# EAGLE design du-ino (EAGLE 6.4)
DRAWING_REVISION: C

## Sheet 1 of 3
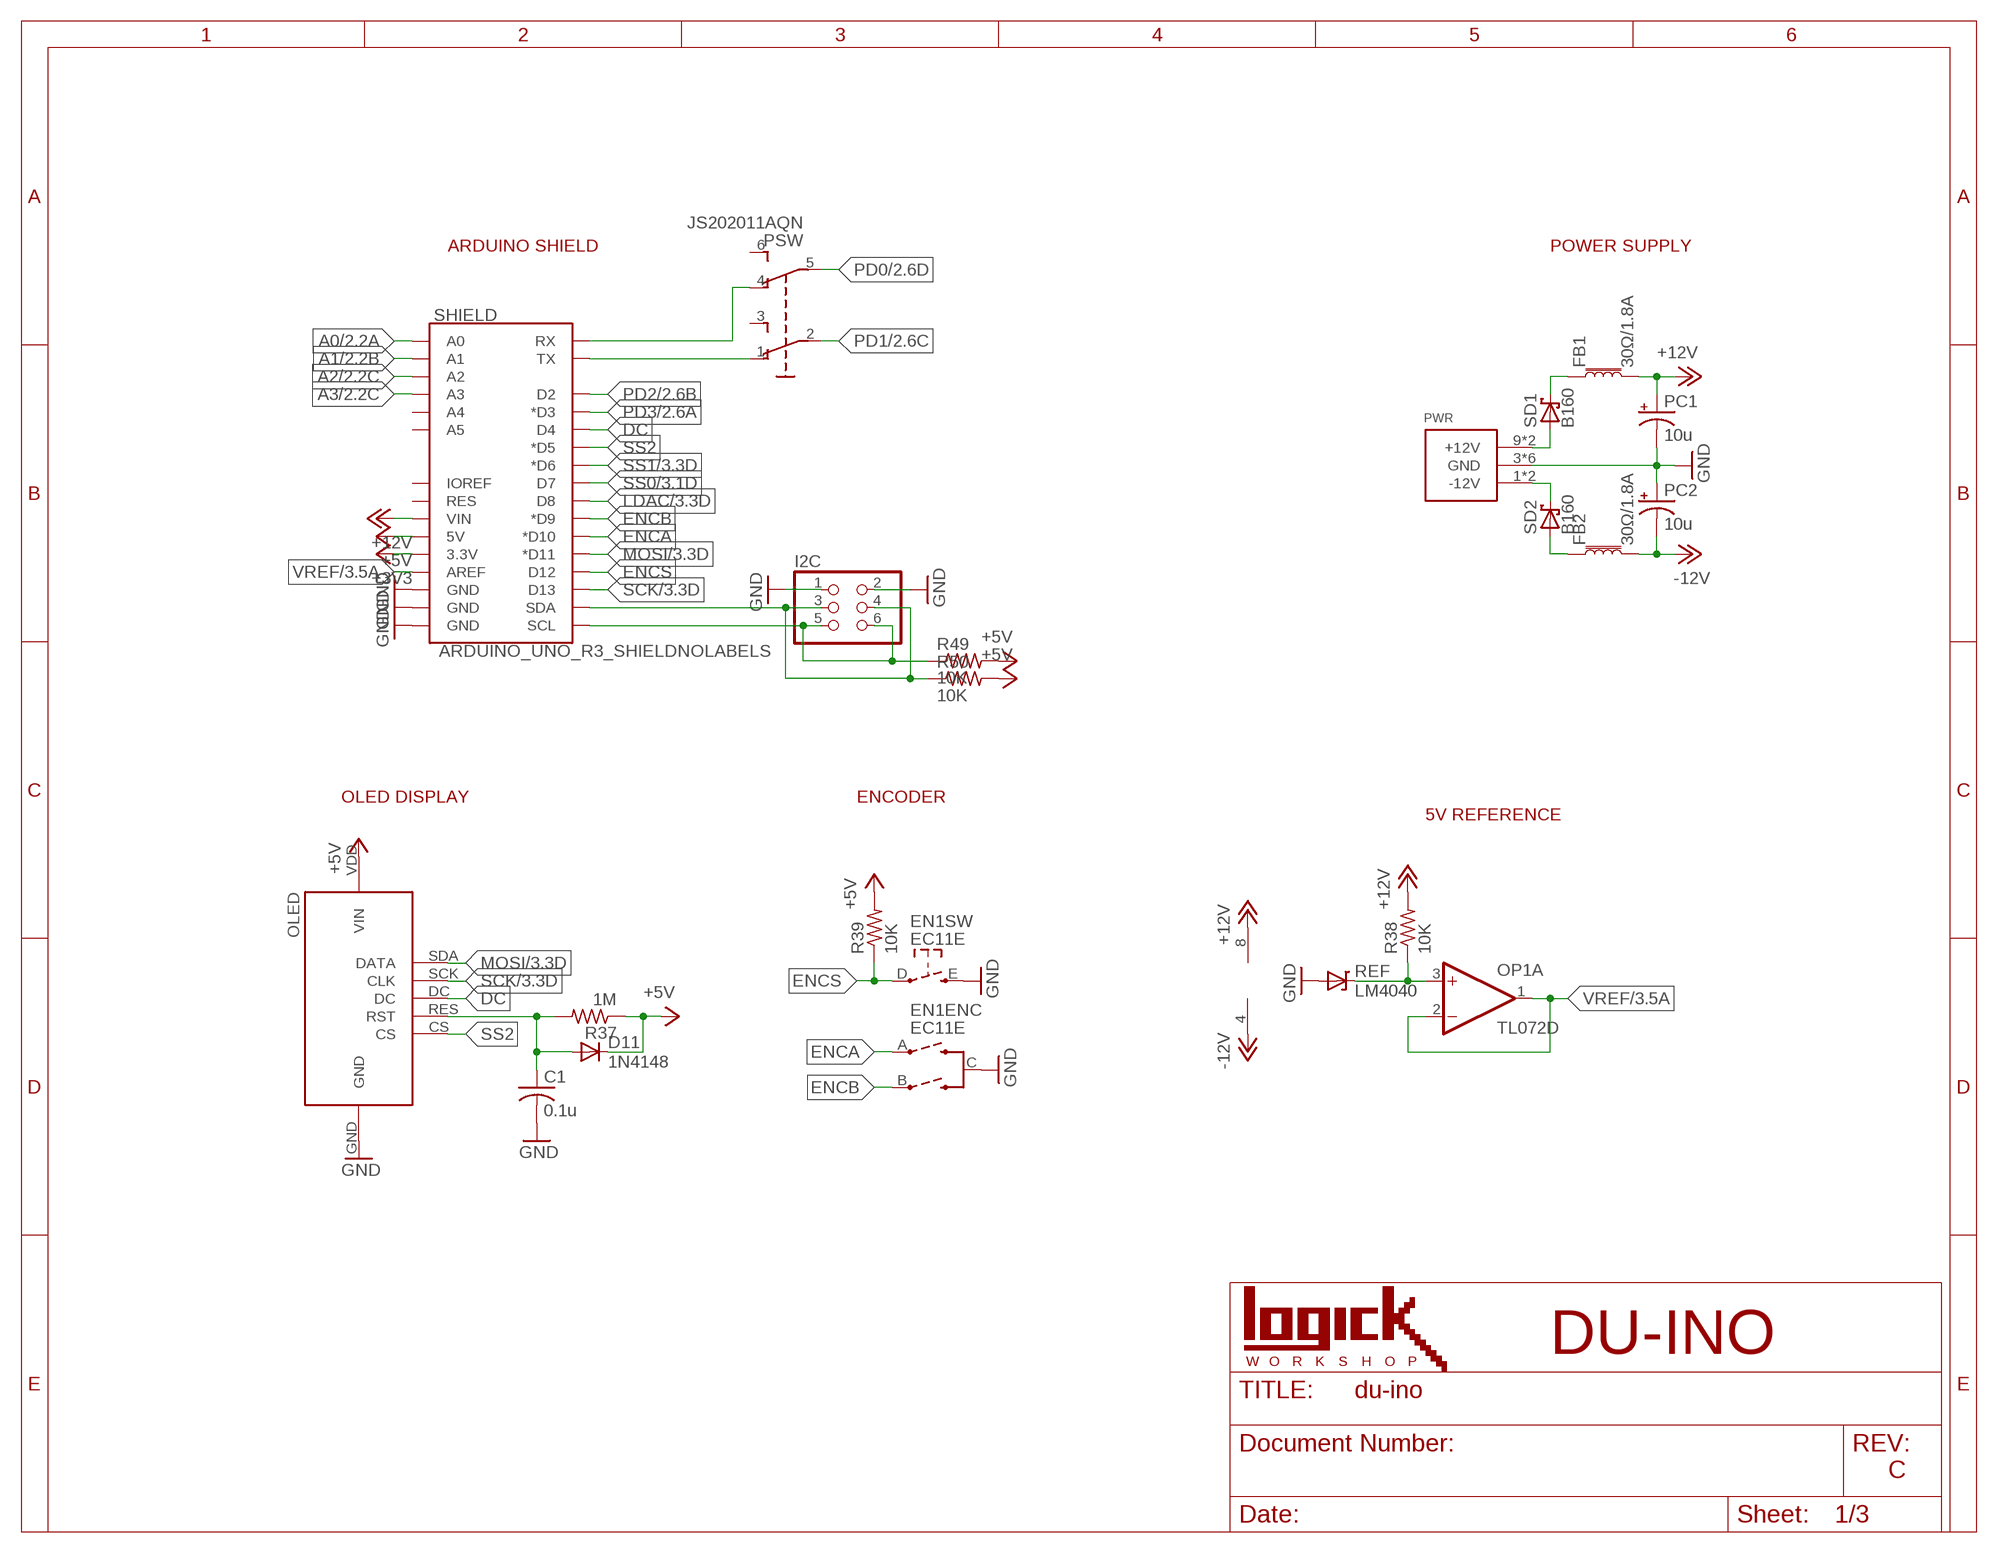
[diagram p0: schematic, sheet 1]

### Parts
C1  0.1u  C-USC0603  [C0603]
D11  1N4148  DIODE-SOD123  [SOD123]
EN1  EC11E  [EC11E]
FB1  30Ω/1.8A  FERRITE_BEAD-0603  [0603]
FB2  30Ω/1.8A  FERRITE_BEAD-0603  [0603]
I2C  PINHD-2X3  [2X03]
OLED  OLED-SAMIORE  [OLED-SAMIORE]
OP1  TL072D  [SO08]
PC1  10u  CPOL-USB  [PANASONIC_B]
PC2  10u  CPOL-USB  [PANASONIC_B]
PSW  JS202011AQN  [JS202011AQN]
PWR  POWER_SIMPLE10  [POWER_10]
R37  1M  R-US_R0603  [R0603]
R38  10K  R-US_R0603  [R0603]
R39  10K  R-US_R0603  [R0603]
R49  10K  R-US_R0603  [R0603]
R50  10K  R-US_R0603  [R0603]
REF  LM4040  [SOT23]
SD1  B160  SCHOTTKY-DIODESMD  [SMB]
SD2  B160  SCHOTTKY-DIODESMD  [SMB]
SHIELD  ARDUINO_UNO_R3_SHIELDNOLABELS  [UNO_R3_SHIELD_NOLABELS]

### Nets
+3V3: SHIELD.3.3V ; also sheet 2
+5V: D11.C OLED.VDD(VIN) R37.1 R39.2 R49.2 R50.2 SHIELD.5V ; also sheet 2,3
+12V: FB1.2 OP1.8(P:V+) PC1.+ R38.2 SHIELD.VIN ; also sheet 2,3
-12V: FB2.2 OP1.4(P:V-) PC2.- ; also sheet 2,3
A0: SHIELD.A0 ; also sheet 2
A1: SHIELD.A1 ; also sheet 2
A2: SHIELD.A2 ; also sheet 2
A3: SHIELD.A3 ; also sheet 2
DC: OLED.DC SHIELD.D4
ENCA: EN1.A(ENC:A) SHIELD.D10(*D10)
ENCB: EN1.B(ENC:B) SHIELD.D9(*D9)
ENCS: EN1.D R39.1 SHIELD.D12
GND: C1.2 EN1.C(ENC:C) EN1.E I2C.1 I2C.2 OLED.GND PC1.- PC2.+ PWR.3(GND) PWR.4(GND) PWR.5(GND) PWR.6(GND) PWR.7(GND) PWR.8(GND) REF.2(A) SHIELD.GND@0(GND) SHIELD.GND@1(GND) SHIELD.GND@2(GND) ; also sheet 2,3
LDAC: SHIELD.D8 ; also sheet 3
MOSI: OLED.SDA(DATA) SHIELD.D11(*D11) ; also sheet 3
N$34: C1.1 D11.A OLED.RES(RST) R37.2
N$57: PWR.1(-12V) PWR.2(-12V) SD2.C
N$58: FB2.1 SD2.A
N$59: FB1.1 SD1.C
N$60: PWR.9(+12V) PWR.10(+12V) SD1.A
N$62: PSW.1(O) SHIELD.TX
N$63: PSW.4(O1) SHIELD.RX
N$68: OP1.3(A:+IN) R38.1 REF.1(C)
PD0: PSW.5(P1) ; also sheet 2
PD1: PSW.2(P) ; also sheet 2
PD2: SHIELD.D2 ; also sheet 2
PD3: SHIELD.D3(*D3) ; also sheet 2
SCK: OLED.SCK(CLK) SHIELD.D13 ; also sheet 3
SCL: I2C.5 I2C.6 R49.1 SHIELD.SCL
SDA: I2C.3 I2C.4 R50.1 SHIELD.SDA
SS0: SHIELD.D7 ; also sheet 3
SS1: SHIELD.D6(*D6) ; also sheet 3
SS2: OLED.CS SHIELD.D5(*D5)
VREF: OP1.1(A:OUT) OP1.2(A:-IN) SHIELD.AREF ; also sheet 3
Unconnected: PSW.3(S) PSW.6(S1) SHIELD.A4 SHIELD.A5 SHIELD.IOREF SHIELD.RES

### Notes on the sheet
- ARDUINO SHIELD | POWER SUPPLY
- OLED DISPLAY | ENCODER
- 5V REFERENCE
- DU-INO
- W | O | R | K | S | H | O | P

## Sheet 2 of 3
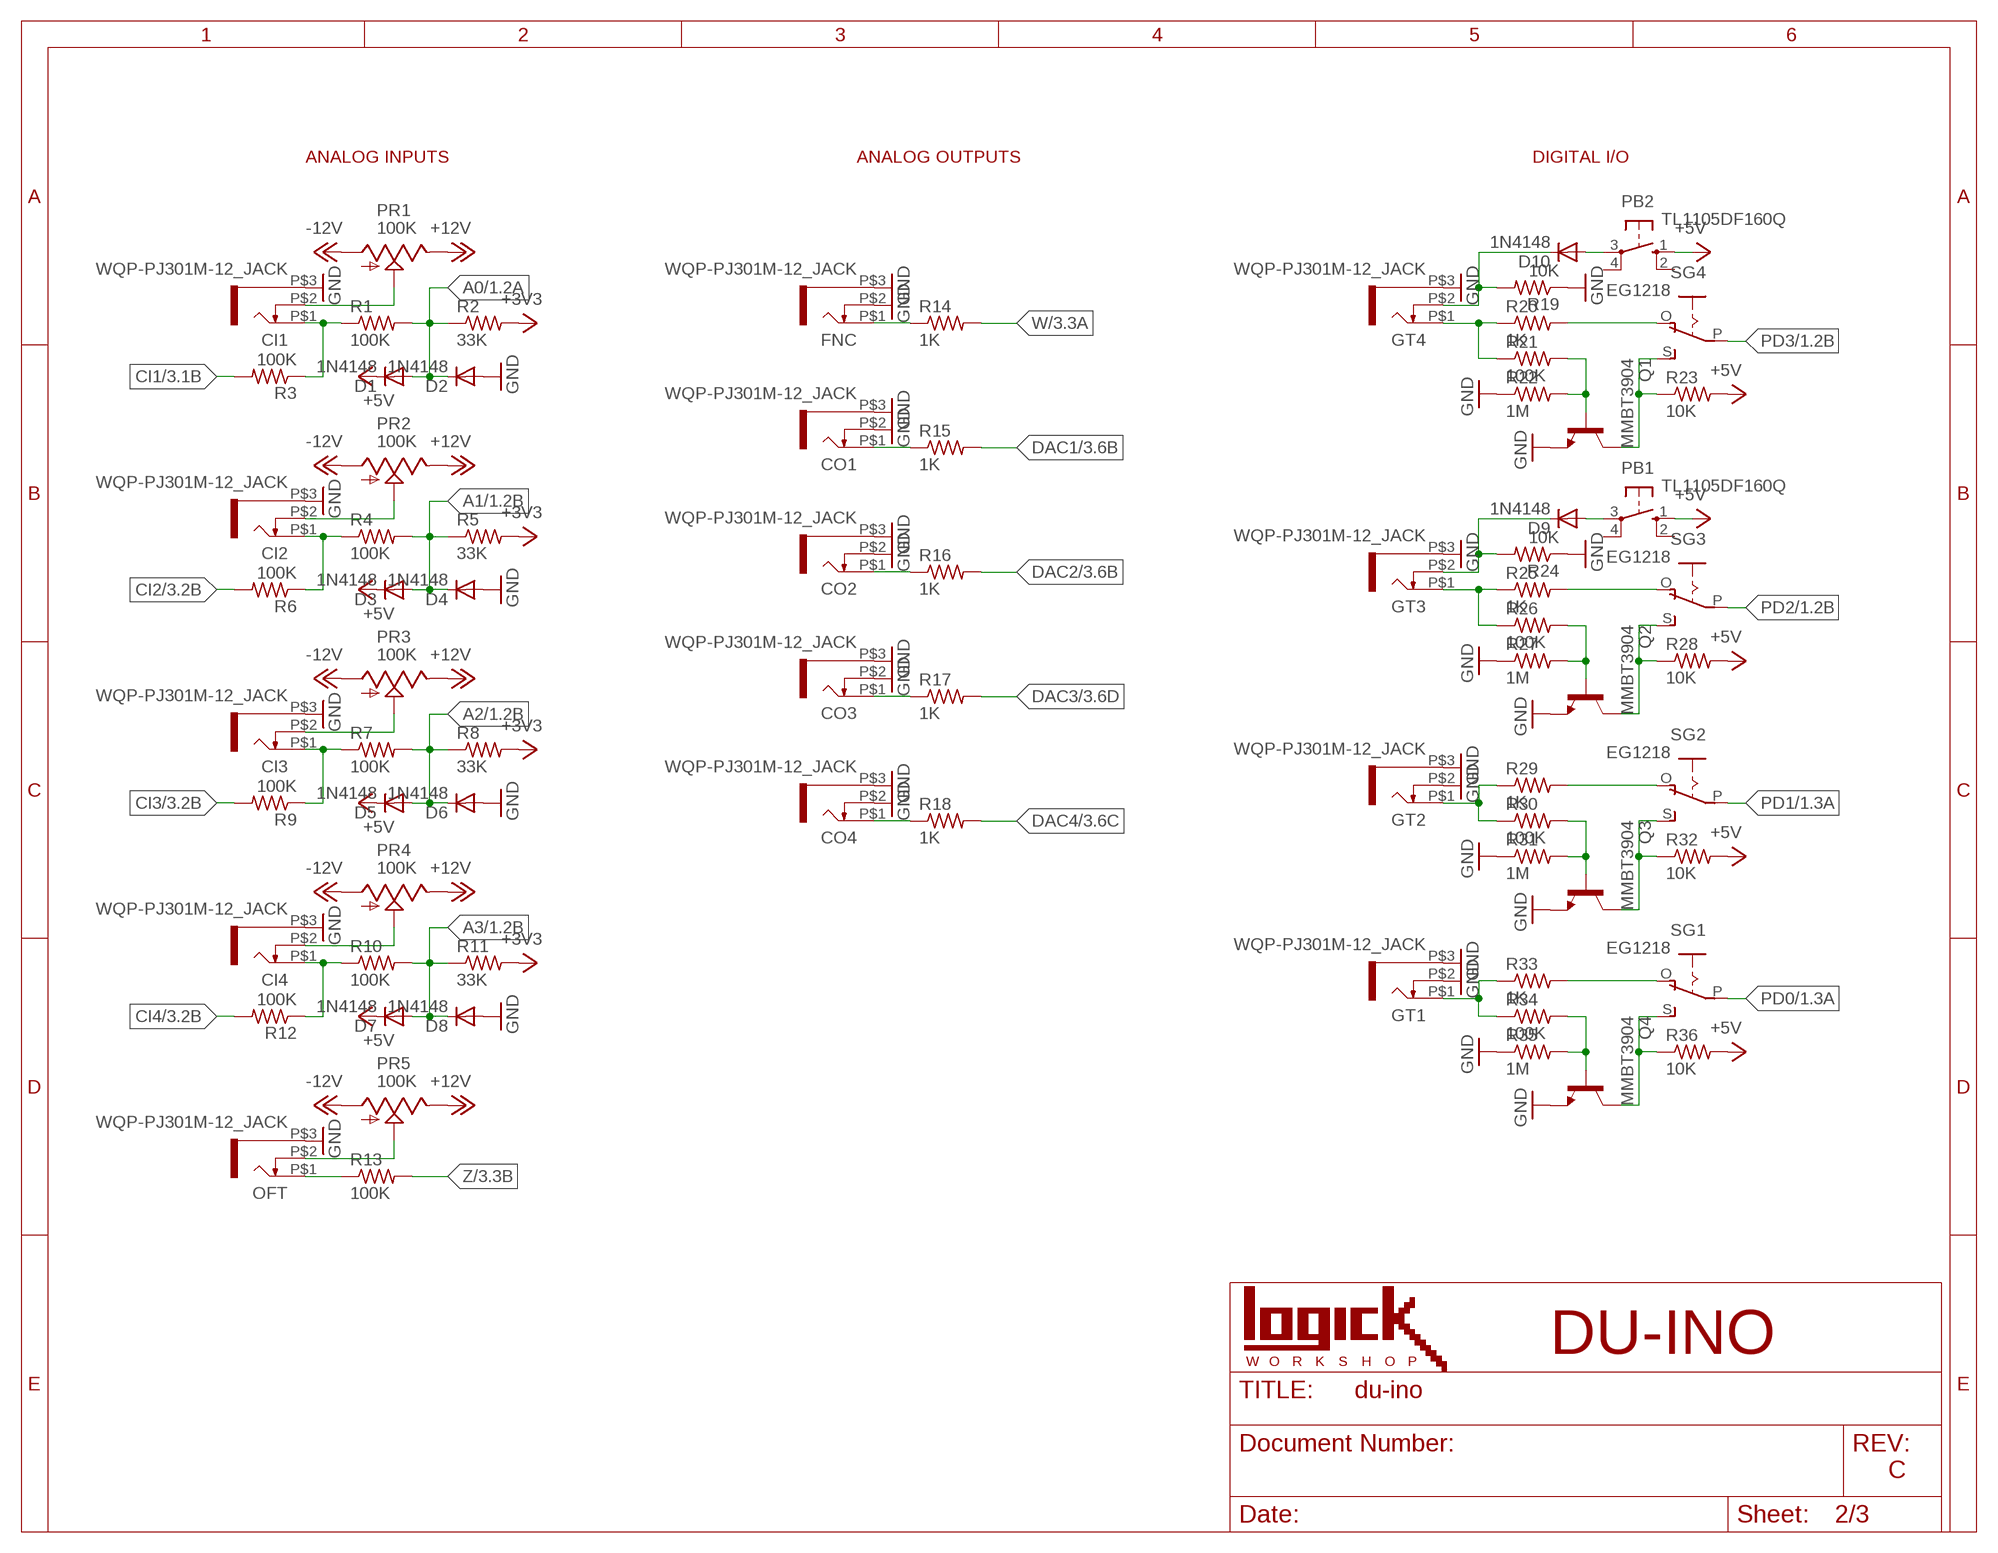
[diagram p1: schematic, sheet 2]

### Parts
CI1  WQP-PJ301M-12_JACK  [WQP-PJ301M-12_JACK]
CI2  WQP-PJ301M-12_JACK  [WQP-PJ301M-12_JACK]
CI3  WQP-PJ301M-12_JACK  [WQP-PJ301M-12_JACK]
CI4  WQP-PJ301M-12_JACK  [WQP-PJ301M-12_JACK]
CO1  WQP-PJ301M-12_JACK  [WQP-PJ301M-12_JACK]
CO2  WQP-PJ301M-12_JACK  [WQP-PJ301M-12_JACK]
CO3  WQP-PJ301M-12_JACK  [WQP-PJ301M-12_JACK]
CO4  WQP-PJ301M-12_JACK  [WQP-PJ301M-12_JACK]
D1  1N4148  DIODE-SOD123  [SOD123]
D2  1N4148  DIODE-SOD123  [SOD123]
D3  1N4148  DIODE-SOD123  [SOD123]
D4  1N4148  DIODE-SOD123  [SOD123]
D5  1N4148  DIODE-SOD123  [SOD123]
D6  1N4148  DIODE-SOD123  [SOD123]
D7  1N4148  DIODE-SOD123  [SOD123]
D8  1N4148  DIODE-SOD123  [SOD123]
D9  1N4148  DIODE-SOD123  [SOD123]
D10  1N4148  DIODE-SOD123  [SOD123]
FNC  WQP-PJ301M-12_JACK  [WQP-PJ301M-12_JACK]
GT1  WQP-PJ301M-12_JACK  [WQP-PJ301M-12_JACK]
GT2  WQP-PJ301M-12_JACK  [WQP-PJ301M-12_JACK]
GT3  WQP-PJ301M-12_JACK  [WQP-PJ301M-12_JACK]
GT4  WQP-PJ301M-12_JACK  [WQP-PJ301M-12_JACK]
OFT  WQP-PJ301M-12_JACK  [WQP-PJ301M-12_JACK]
PB1  TL1105DF160Q  10-XX  [B3F-10XX]
PB2  TL1105DF160Q  10-XX  [B3F-10XX]
PR1  100K  R0904N  [R0904N]
PR2  100K  R0904N  [R0904N]
PR3  100K  R0904N  [R0904N]
PR4  100K  R0904N  [R0904N]
PR5  100K  R0904N  [R0904N]
Q1  MMBT3904  MMBT3904LT1-NPN-SOT23-BEC  [SOT23-BEC]
Q2  MMBT3904  MMBT3904LT1-NPN-SOT23-BEC  [SOT23-BEC]
Q3  MMBT3904  MMBT3904LT1-NPN-SOT23-BEC  [SOT23-BEC]
Q4  MMBT3904  MMBT3904LT1-NPN-SOT23-BEC  [SOT23-BEC]
R1  100K  R-US_R0603  [R0603]
R2  33K  R-US_R0603  [R0603]
R3  100K  R-US_R0603  [R0603]
R4  100K  R-US_R0603  [R0603]
R5  33K  R-US_R0603  [R0603]
R6  100K  R-US_R0603  [R0603]
R7  100K  R-US_R0603  [R0603]
R8  33K  R-US_R0603  [R0603]
R9  100K  R-US_R0603  [R0603]
R10  100K  R-US_R0603  [R0603]
R11  33K  R-US_R0603  [R0603]
R12  100K  R-US_R0603  [R0603]
R13  100K  R-US_R0603  [R0603]
R14  1K  R-US_R0603  [R0603]
R15  1K  R-US_R0603  [R0603]
R16  1K  R-US_R0603  [R0603]
R17  1K  R-US_R0603  [R0603]
R18  1K  R-US_R0603  [R0603]
R19  10K  R-US_R0603  [R0603]
R20  1K  R-US_R0603  [R0603]
R21  100K  R-US_R0603  [R0603]
R22  1M  R-US_R0603  [R0603]
R23  10K  R-US_R0603  [R0603]
R24  10K  R-US_R0603  [R0603]
R25  1K  R-US_R0603  [R0603]
R26  100K  R-US_R0603  [R0603]
R27  1M  R-US_R0603  [R0603]
R28  10K  R-US_R0603  [R0603]
R29  1K  R-US_R0603  [R0603]
R30  100K  R-US_R0603  [R0603]
R31  1M  R-US_R0603  [R0603]
R32  10K  R-US_R0603  [R0603]
R33  1K  R-US_R0603  [R0603]
R34  100K  R-US_R0603  [R0603]
R35  1M  R-US_R0603  [R0603]
R36  10K  R-US_R0603  [R0603]
SG1  EG1218  EG1218S  [EG1218]
SG2  EG1218  EG1218S  [EG1218]
SG3  EG1218  EG1218S  [EG1218]
SG4  EG1218  EG1218S  [EG1218]

### Nets
+3V3: R2.2 R5.2 R8.2 R11.2 ; also sheet 1
+5V: D1.C D3.C D5.C D7.C PB1.1(S) PB2.1(S) R23.2 R28.2 R32.2 R36.2 ; also sheet 1,3
+12V: PR1.3(E) PR2.3(E) PR3.3(E) PR4.3(E) PR5.3(E) ; also sheet 1,3
-12V: PR1.1(A) PR2.1(A) PR3.1(A) PR4.1(A) PR5.1(A) ; also sheet 1,3
A0: D1.A D2.C R1.2 R2.1 ; also sheet 1
A1: D3.A D4.C R4.2 R5.1 ; also sheet 1
A2: D5.A D6.C R7.2 R8.1 ; also sheet 1
A3: D7.A D8.C R10.2 R11.1 ; also sheet 1
CI1: R3.2 ; also sheet 3
CI2: R6.2 ; also sheet 3
CI3: R9.2 ; also sheet 3
CI4: R12.2 ; also sheet 3
DAC1: R15.2 ; also sheet 3
DAC2: R16.2 ; also sheet 3
DAC3: R17.2 ; also sheet 3
DAC4: R18.2 ; also sheet 3
GND: CI1.P$3 CI2.P$3 CI3.P$3 CI4.P$3 CO1.P$2 CO1.P$3 CO2.P$2 CO2.P$3 CO3.P$2 CO3.P$3 CO4.P$2 CO4.P$3 D2.A D4.A D6.A D8.A FNC.P$2 FNC.P$3 GT1.P$2 GT1.P$3 GT2.P$2 GT2.P$3 GT3.P$3 GT4.P$3 OFT.P$3 Q1.E Q2.E Q3.E Q4.E R19.1 R22.1 R24.1 R27.1 R31.1 R35.1 ; also sheet 1,3
N$3: CI1.P$2 PR1.2(S)
N$4: CI2.P$2 PR2.2(S)
N$5: CI3.P$2 PR3.2(S)
N$6: CI4.P$2 PR4.2(S)
N$7: OFT.P$2 PR5.2(S)
N$8: OFT.P$1 R13.1
N$9: CI1.P$1 R1.1 R3.1
N$10: CI2.P$1 R4.1 R6.1
N$11: CI3.P$1 R7.1 R9.1
N$12: CI4.P$1 R10.1 R12.1
N$13: GT1.P$1 R33.1 R34.1
N$14: FNC.P$1 R14.1
N$17: GT3.P$1 R25.1 R26.1
N$18: GT4.P$1 R20.1 R21.1
N$19: GT2.P$1 R29.1 R30.1
N$22: CO1.P$1 R15.1
N$23: CO2.P$1 R16.1
N$24: CO4.P$1 R18.1
N$25: CO3.P$1 R17.1
N$26: R25.2 SG3.O
N$27: R20.2 SG4.O
N$28: R29.2 SG2.O
N$29: R33.2 SG1.O
N$30: Q2.C R28.1 SG3.S
N$31: Q1.B R21.2 R22.2
N$32: Q1.C R23.1 SG4.S
N$33: Q3.B R30.2 R31.2
N$42: Q2.B R26.2 R27.2
N$46: Q3.C R32.1 SG2.S
N$47: Q4.B R34.2 R35.2
N$48: Q4.C R36.1 SG1.S
N$49: D9.A PB1.3(P)
N$50: D9.C GT3.P$2 R24.2
N$52: D10.A PB2.3(P)
N$53: D10.C GT4.P$2 R19.2
PD0: SG1.P ; also sheet 1
PD1: SG2.P ; also sheet 1
PD2: SG3.P ; also sheet 1
PD3: SG4.P ; also sheet 1
W: R14.2 ; also sheet 3
Z: R13.2 ; also sheet 3
Unconnected: PB1.2(S1) PB1.4(P1) PB2.2(S1) PB2.4(P1)

### Notes on the sheet
- ANALOG INPUTS | ANALOG OUTPUTS | DIGITAL I/O
- DU-INO
- W | O | R | K | S | H | O | P

## Sheet 3 of 3
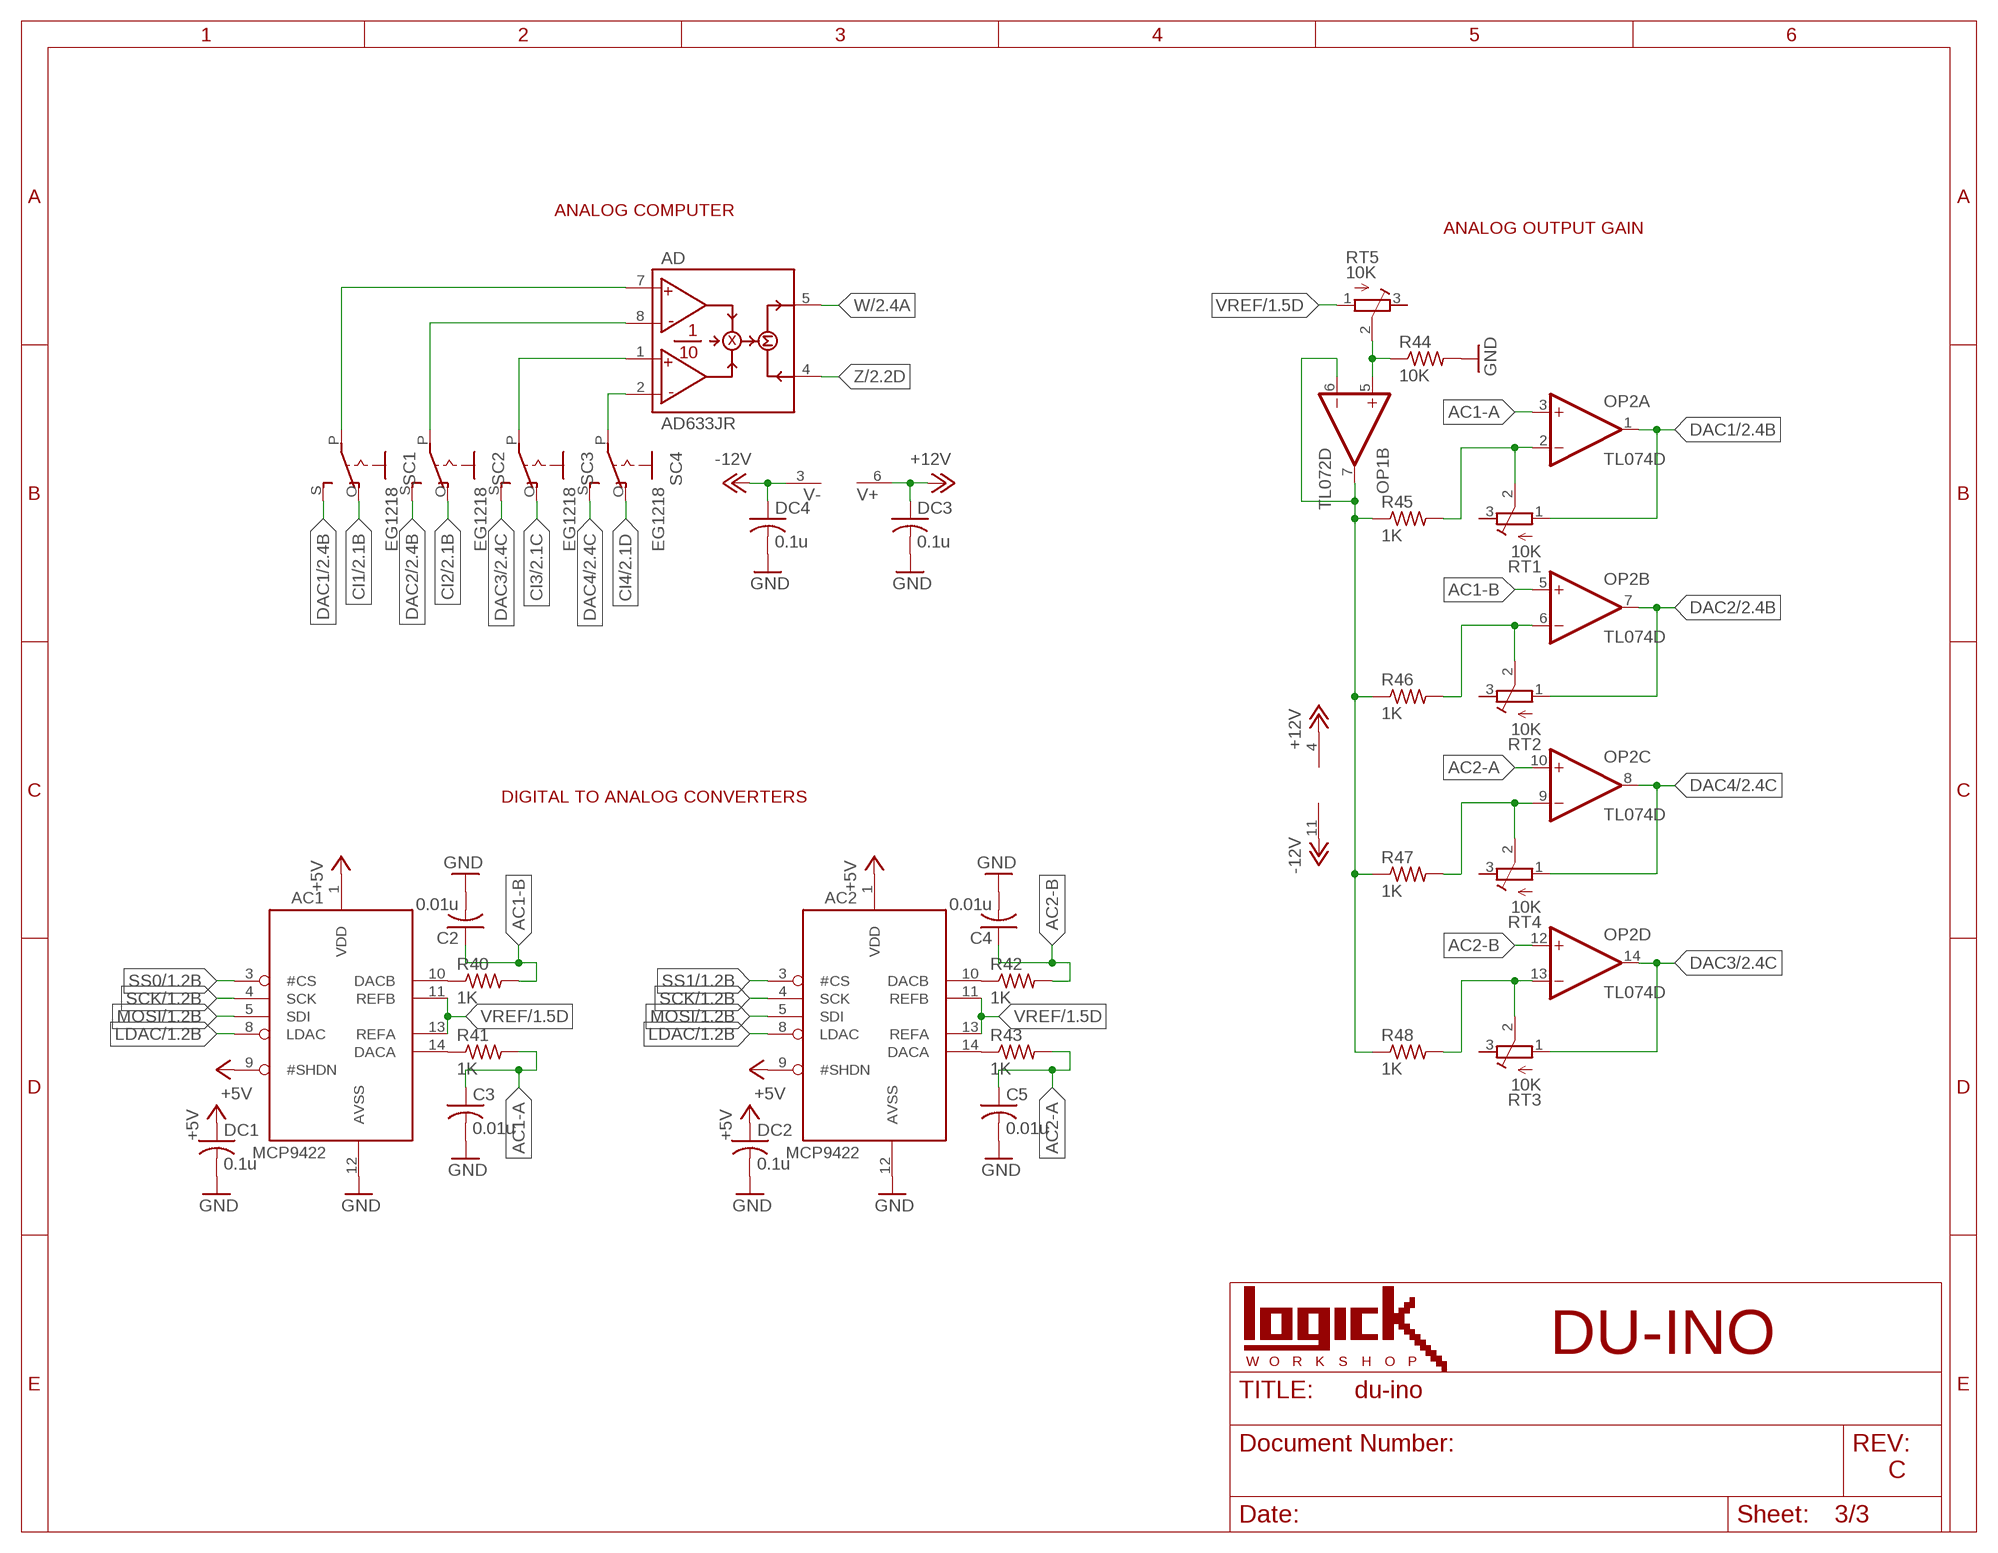
[diagram p2: schematic, sheet 3]

### Parts
AC1  MCP4922E/SL  [SO14]
AC2  MCP4922E/SL  [SO14]
AD  AD633JR  [SO8]
C2  0.01u  C-USC0603  [C0603]
C3  0.01u  C-USC0603  [C0603]
C4  0.01u  C-USC0603  [C0603]
C5  0.01u  C-USC0603  [C0603]
DC1  0.1u  C-USC0603  [C0603]
DC2  0.1u  C-USC0603  [C0603]
DC3  0.1u  C-USC0603  [C0603]
DC4  0.1u  C-USC0603  [C0603]
OP2  TL074D  [SO14]
R40  1K  R-US_R0603  [R0603]
R41  1K  R-US_R0603  [R0603]
R42  1K  R-US_R0603  [R0603]
R43  1K  R-US_R0603  [R0603]
R44  10K  R-US_R0603  [R0603]
R45  1K  R-US_R0603  [R0603]
R46  1K  R-US_R0603  [R0603]
R47  1K  R-US_R0603  [R0603]
R48  1K  R-US_R0603  [R0603]
RT1  10K  R-TRIMM3296W  [RTRIM3296W]
RT2  10K  R-TRIMM3296W  [RTRIM3296W]
RT3  10K  R-TRIMM3296W  [RTRIM3296W]
RT4  10K  R-TRIMM3296W  [RTRIM3296W]
RT5  10K  R-TRIMM3296W  [RTRIM3296W]
SC1  EG1218  EG1218S  [EG1218]
SC2  EG1218  EG1218S  [EG1218]
SC3  EG1218  EG1218S  [EG1218]
SC4  EG1218  EG1218S  [EG1218]

### Nets
+5V: AC1.1(VDD) AC1.9(#SHDN) AC2.1(VDD) AC2.9(#SHDN) DC1.1 DC2.1 ; also sheet 1,2
+12V: AD.6(V+) DC3.1 OP2.4(P:V+) ; also sheet 1,2
-12V: AD.3(V-) DC4.1 OP2.11(P:V-) ; also sheet 1,2
AC1-A: C3.1 OP2.3(A:+IN) R41.2
AC1-B: C2.1 OP2.5(B:+IN) R40.2
AC2-A: C5.1 OP2.10(C:+IN) R43.2
AC2-B: C4.1 OP2.12(D:+IN) R42.2
CI1: SC1.O ; also sheet 2
CI2: SC2.O ; also sheet 2
CI3: SC3.O ; also sheet 2
CI4: SC4.O ; also sheet 2
DAC1: OP2.1(A:OUT) RT1.1(A) SC1.S ; also sheet 2
DAC2: OP2.7(B:OUT) RT2.1(A) SC2.S ; also sheet 2
DAC3: OP2.14(D:OUT) RT3.1(A) SC3.S ; also sheet 2
DAC4: OP2.8(C:OUT) RT4.1(A) SC4.S ; also sheet 2
GND: AC1.12(AVSS) AC2.12(AVSS) C2.2 C3.2 C4.2 C5.2 DC1.2 DC2.2 DC3.2 DC4.2 R44.2 ; also sheet 1,2
LDAC: AC1.8(LDAC) AC2.8(LDAC) ; also sheet 1
MOSI: AC1.5(SDI) AC2.5(SDI) ; also sheet 1
N$15: AD.2(Y2) SC4.P
N$16: AD.1(Y1) SC3.P
N$20: AD.8(X2) SC2.P
N$21: AD.7(X1) SC1.P
N$35: OP2.2(A:-IN) R45.2 RT1.2(S)
N$36: OP2.6(B:-IN) R46.2 RT2.2(S)
N$37: OP1.6(B:-IN) OP1.7(B:OUT) R45.1 R46.1 R47.1 R48.1
N$39: OP2.9(C:-IN) R47.2 RT4.2(S)
N$41: OP2.13(D:-IN) R48.2 RT3.2(S)
N$51: AC1.10(DACB) R40.1
N$54: AC1.14(DACA) R41.1
N$55: AC2.10(DACB) R42.1
N$56: AC2.14(DACA) R43.1
N$64: OP1.5(B:+IN) R44.1 RT5.2(S)
SCK: AC1.4(SCK) AC2.4(SCK) ; also sheet 1
SS0: AC1.3(#CS) ; also sheet 1
SS1: AC2.3(#CS) ; also sheet 1
VREF: AC1.11(REFB) AC1.13(REFA) AC2.11(REFB) AC2.13(REFA) RT5.1(A) ; also sheet 1
W: AD.5(W) ; also sheet 2
Z: AD.4(Z) ; also sheet 2
Unconnected: RT1.3(E) RT2.3(E) RT3.3(E) RT4.3(E) RT5.3(E)

### Notes on the sheet
- ANALOG COMPUTER
- ANALOG OUTPUT GAIN
- DIGITAL TO ANALOG CONVERTERS
- DU-INO
- W | O | R | K | S | H | O | P

## Library data of the parts
AC1 AC2 = logick:MCP4922
AD = ad633-2:AD633*
C1-C5 DC1-DC4 = resistor:C-US: CAPACITOR, American symbol
CI1-CI4 CO1-CO4 FNC GT1-GT4 OFT = thonkiconn:WQP-PJ301M-12_JACK
D1-D11 = diode:DIODE-: DIODE
EN1 = logick:EC11
FB1 FB2 = SparkFun-Coils:FERRITE_BEAD: Ferrite Bead (blocks, cores, rings, chokes, etc.) Inductor with layers of ferrite used to suppress high frequencies. Often used to isolate high frequency noise. SparkFun Products: IOIO-OTG - V2.2 <https://www.sparkfun.com/products/13613> SparkFun SAMD21 Mini Breakout <https://www.sparkfun.com/products/13664> SparkFun 6 Degrees of Freedom Breakout - LSM6DS3 <https://www.sparkfun.com/products/13339> SparkFun SAMD21 Dev Breakout <https://www.sparkfun.com/products/13672>; PROD_ID: NDUC-07859
I2C = pinhead:PINHD-2X3: PIN HEADER
OLED = logick:OLED-SAMIORE
OP1 = linear:TL072: OP AMP
OP2 = linear:TL074: OP AMP
PB1 PB2 = switch-omron:10-XX: OMRON SWITCH; MPN: B3F-1000; OC_FARNELL: 176432; OC_NEWARK: 36M3542
PC1 PC2 = resistor:CPOL-US: POLARIZED CAPACITOR, American symbol
PR1-PR5 = logick:R0904N
PSW = logick:JS202011AQN
PWR = eurorack:POWER_SIMPLE
Q1-Q4 = transistor:*-NPN-: NPN Transistror BF959 corrected 2008.03.06
R1-R18 R20-R23 R25-R50 = adafruit:R-US_: RESISTOR, American symbol
R19 R24 = resistor:R-US_: RESISTOR, American symbol
REF = lzx-industries:LM4040
RT1-RT5 = rcl:R-TRIMM: Trimm resistor
SC1-SC4 SG1-SG4 = adafruit:EG1218: SLIDING SWITCH 0.1" spacing through hole, vertical SPDT slide switch http://www.ladyada.net/library/pcb/eaglelibrary.html
SD1 SD2 = diode:SCHOTTKY-DIODE: Schottky Diode
SHIELD = SparkFun-Boards:ARDUINO_UNO_R3_SHIELD: Arduino R3 Shield Footprint Shield form compatible with the Arduino Uno R3. SparkFun Products: MG2639 Cellular Shield <https://www.sparkfun.com/products/13120> MIDI Shield <https://www.sparkfun.com/products/12898> R3 Stackable Headers Kit <https://www.sparkfun.com/products/11417>

## Board
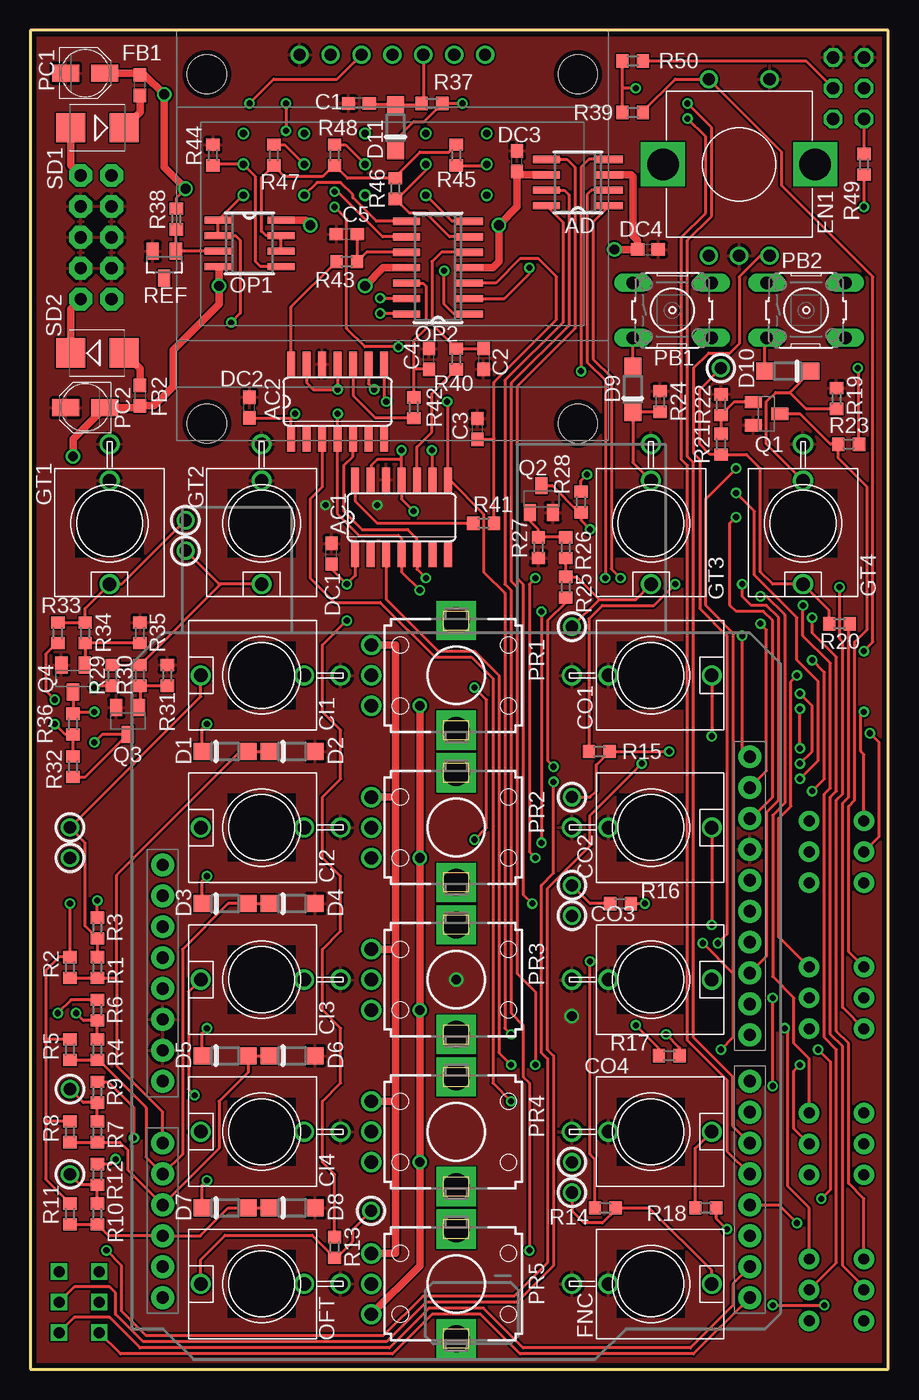
[diagram p3: board, top side]
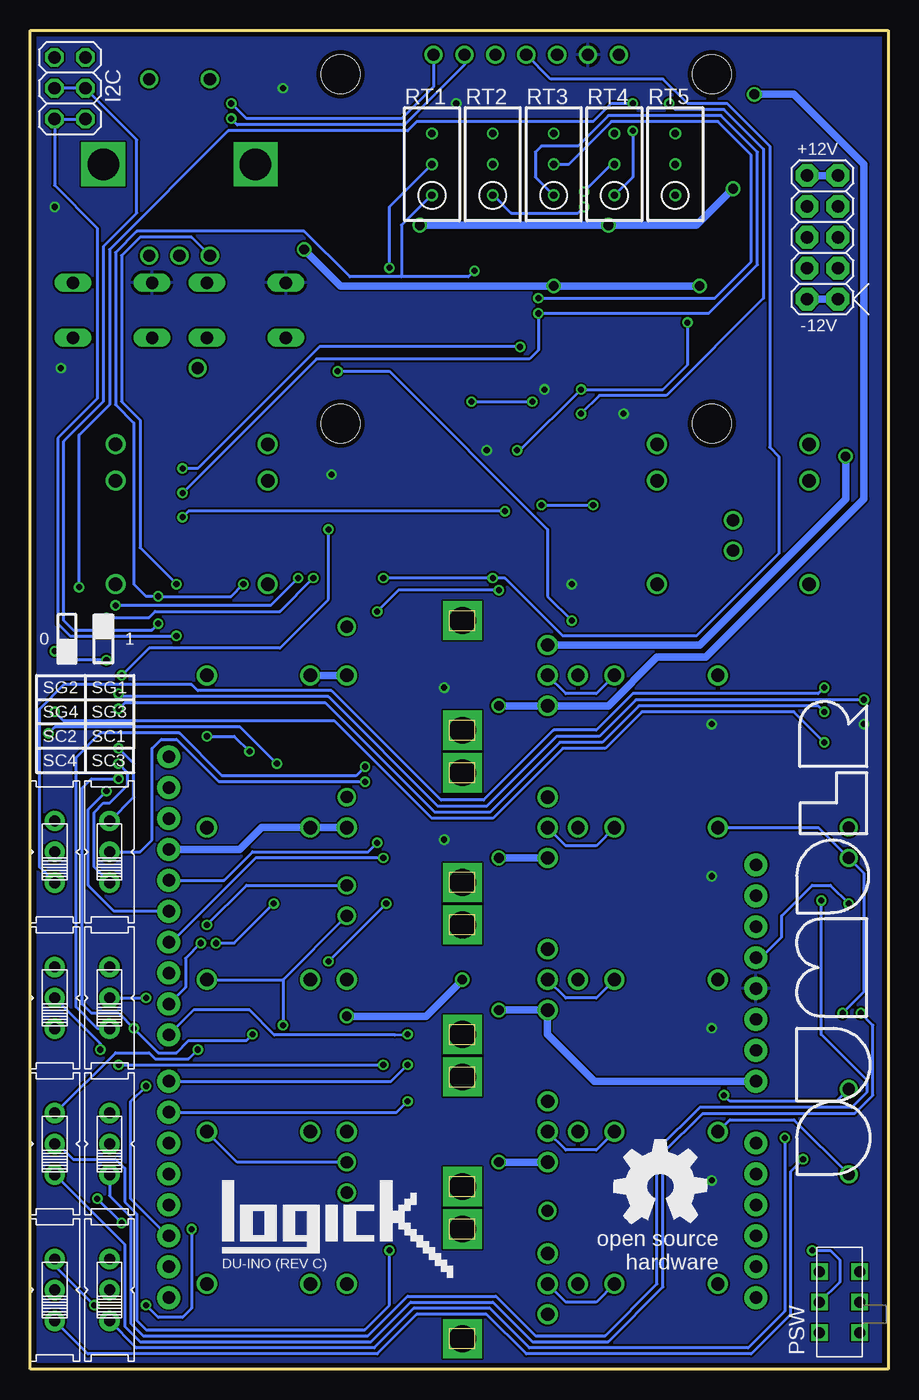
[diagram p4: board, bottom side, seen from below]

Size 70.5 x 110 mm. Coordinates in mm from the lower left corner, seen from the top.
Outline: 0,0 70.5,0 70.5,110 0,110 0,0
Copper layers (1*16): Top 0.0356mm / dielectric 1.5011mm / Bottom 0.0356mm
Design rules "oshpark-2layer": minimum track width 6mil, minimum drill 13mil, track to track 6mil, track to pad 6mil, pad to pad 6mil, via to via 6mil, smd to smd 6mil, copper to edge 15mil, drill to drill 6mil, minimum pad ring 7mil, minimum via ring 7mil, stop-mask expansion 2.5mil, vias tented up to drill 0mil, thermal gap 10mil

### Footprints (pad centres in the part's own frame; a part is rotated, then mirrored left to right if it is on the bottom)
SO14 = smd 0.66 x 2.032: 1 -3.81,-3.073; 2 -2.54,-3.073; 3 -1.27,-3.073; 4 0,-3.073; 5 1.27,-3.073; 6 2.54,-3.073; 7 3.81,-3.073; 8 3.81,3.073; 9 2.54,3.073; 10 1.27,3.073; 11 0,3.073; 12 -1.27,3.073; 13 -2.54,3.073; 14 -3.81,3.073
SO8 = smd 0.6 x 2.2: 1 -1.905,-2.6; 2 -0.635,-2.6; 3 0.635,-2.6; 4 1.905,-2.6; 5 1.905,2.6; 6 0.635,2.6; 7 -0.635,2.6; 8 -1.905,2.6
C0603 = smd 1.1 x 1: 1 -0.85,0; 2 0.85,0
WQP-PJ301M-12_JACK = drill 1.1: P$1 0,5; P$2 0,-3.5; P$3 0,-6.5
SOD123 = smd 1.4 x 1.4: A 1.9,0; C -1.9,0
EC11E = drill 1: A -2.5,-7.5; B 2.5,-7.5; C 0,-7.5; D -2.5,7; E 2.5,7 | drill 2.6 square: P$6 -6.25,0; P$7 6.25,0
0603 = smd 1.1 x 1: 1 -0.85,0; 2 0.85,0
2X03 = drill 1.016 octagon: 1 -2.54,-1.27; 2 -2.54,1.27; 3 0,-1.27; 4 0,1.27; 5 2.54,-1.27; 6 2.54,1.27
OLED-SAMIORE = drill 1: CS 7.62,0; DC 5.08,0; GND -7.62,0; RES 2.54,0; SCK -2.54,0; SDA 0,0; VDD -5.08,0 | hole 3.2: -15.25,-1.6; 15.25,-1.6; -15.25,-30.3; 15.25,-30.3
SO08 = smd 0.6 x 2.2: 1 -1.905,-2.6; 2 -0.635,-2.6; 3 0.635,-2.6; 4 1.905,-2.6; 5 1.905,2.6; 6 0.635,2.6; 7 -0.635,2.6; 8 -1.905,2.6
SO14' = smd 0.6 x 2.2: 1 -3.81,-2.6; 2 -2.54,-2.6; 3 -1.27,-2.6; 4 0,-2.6; 5 1.27,-2.6; 6 2.54,-2.6; 7 3.81,-2.6; 8 3.81,2.6; 9 2.54,2.6; 10 1.27,2.6; 11 0,2.6; 12 -1.27,2.6; 13 -2.54,2.6; 14 -3.81,2.6
B3F-10XX = drill 1.016 long: 1 -3.251,2.261; 2 3.251,2.261; 3 -3.251,-2.261; 4 3.251,-2.261
PANASONIC_B = smd 2.2 x 1.4: + 1.6,0; - -1.6,0
R0904N = drill 1.1 pad 1.676: 1 -2.5,-7; 2 0,-7; 3 2.5,-7 | drill 2.2 square: M1 -4.5,0; M2 4.5,0
JS202011AQN = drill 0.9 square: 1 -2.5,-1.65; 2 0,-1.65; 3 2.5,-1.65; 4 -2.5,1.65; 5 0,1.65; 6 2.5,1.65
POWER_10 = drill 1.016 pad 1.88 octagon: 1 -5.08,-1.27; 2 -5.08,1.27; 3 -2.54,-1.27; 4 -2.54,1.27; 5 0,-1.27; 6 0,1.27; 7 2.54,-1.27; 8 2.54,1.27; 9 5.08,-1.27; 10 5.08,1.27
SOT23-BEC = smd 1 x 1.4: B -0.95,-1.1; C 0,1.1; E 0.95,-1.1
R0603 = smd 1 x 1.1: 1 -0.85,0; 2 0.85,0
SOT23 = smd 1 x 1.4: 1 -0.95,-1.1; 2 0.95,-1.1; 3 0,1.1
RTRIM3296W = drill 0.61: 1 0,-2.54; 2 0,0; 3 0,2.54
EG1218 = drill 0.9 pad 1.676: O -2.54,0; P 0,0; S 2.54,0
SMB = smd 2.4 x 2.4: A 2.2,0; C -2.2,0
UNO_R3_SHIELD_NOLABELS = drill 1.016 pad 1.88: 3.3V 24.13,-3.81; 5V 24.13,-1.27; A0 24.13,11.43; A1 24.13,13.97; A2 24.13,16.51; A3 24.13,19.05; A4 24.13,21.59; A5 24.13,24.13; AREF -24.13,-15.24; D2 -24.13,19.05; D3 -24.13,16.51; D4 -24.13,13.97; D5 -24.13,11.43; D6 -24.13,8.89; D7 -24.13,6.35; D8 -24.13,2.54; D9 -24.13,0; D10 -24.13,-2.54; D11 -24.13,-5.08; D12 -24.13,-7.62; D13 -24.13,-10.16; GND@0 24.13,1.27; GND@1 24.13,3.81; GND@2 -24.13,-12.7; IOREF 24.13,-8.89; NC 24.13,-11.43; RES 24.13,-6.35; RX -24.13,24.13; SCL -24.13,-20.32; SDA -24.13,-17.78; TX -24.13,21.59; VIN 24.13,6.35

### Placement (x,y rotation side)
AC1  30.5,70 0 top
AC2  25.25,79.5 0 top
AD  45,97.5 90 top
C1  27,104 180 top
C2  37.25,83 270 top
C3  36.75,77.25 90 top
C4  32.75,83 90 top
C5  26,93.25 180 top
CI1  19,57 90 top
CI2  19,44.5 90 top
CI3  19,32 90 top
CI4  19,19.5 90 top
CO1  51,57 270 top
CO2  51,44.5 270 top
CO3  51,32 270 top
CO4  51,19.5 270 top
D1  16,50.75 0 top
D2  21.5,50.75 0 top
D3  16,38.25 0 top
D4  21.5,38.25 0 top
D5  16,25.75 0 top
D6  21.5,25.75 0 top
D7  16,13.25 0 top
D8  21.5,13.25 0 top
D9  49.5,80.5 90 top
D10  62.25,82 180 top
D11  30,102 90 top
DC1  24.75,67 90 top
DC2  18,79 90 top
DC3  40,99.25 90 top
DC4  50.75,92 0 top
EN1  58.25,99 0 top
FB1  9,105.5 90 top
FB2  9,80 270 top
FNC  51,7 270 top
GT1  6.5,69.5 180 top
GT2  19,69.5 180 top
GT3  51,69.5 180 top
GT4  63.5,69.5 180 top
I2C  67.25,105.25 270 bottom
OFT  19,7 90 top
OLED  29.75,108 0 top
OP1  18,92.5 270 top
OP2  TL074D  [SO14']  33.5,90.5 90 top
PB1  52.75,87 0 top
PB2  63.75,87 0 top
PC1  4.5,106.5 0 top
PC2  4.5,79 180 top
PR1  35,57 270 top
PR2  35,44.5 270 top
PR3  35,32 270 top
PR4  35,19.5 270 top
PR5  35,7 270 top
PSW  4,5.5 90 bottom
PWR  5.4,93 90 bottom
Q1  60.5,78.5 270 top
Q2  42,71.5 0 top
Q3  8,53.25 180 top
Q4  3.5,56.75 180 top
R1  5.5,33 270 top
R2  3.25,33 90 top
R3  5.5,36.25 90 top
R4  5.5,26.25 270 top
R5  3.25,26.25 90 top
R6  5.5,29.5 90 top
R7  5.5,19.5 270 top
R8  3.25,19.5 90 top
R9  5.5,22.75 90 top
R10  5.5,12.75 270 top
R11  3.25,12.75 90 top
R12  5.5,16 90 top
R13  25,10 90 top
R14  47.25,13.25 180 top
R15  46.75,50.75 180 top
R16  48.5,38.25 0 top
R17  52.5,25.75 0 top
R18  55.5,13.25 0 top
R19  66.25,79.75 270 top
R20  66.5,61.25 0 top
R21  56.75,76 90 top
R22  56.75,79.25 270 top
R23  67.25,76 0 top
R24  51.75,79.5 270 top
R25  44,64.25 270 top
R26  44,67.5 90 top
R27  41.75,67.5 90 top
R28  45.25,71.25 90 top
R29  6.75,57 270 top
R30  9,57 270 top
R31  11.25,57 270 top
R32  3.5,49.5 90 top
R33  2.25,60.5 270 top
R34  4.5,60.5 270 top
R35  9,60.5 270 top
R36  3.5,53 270 top
R37  33,104 180 top
R38  12,94.5 90 top
R39  49.5,103.25 180 top
R40  35,83 90 top
R41  37.25,69.5 0 top
R42  31.5,79 90 top
R43  26,91 0 top
R44  15,99.75 90 top
R45  35,99.75 270 top
R46  30,97 270 top
R47  20,99.75 90 top
R48  25,99.75 90 top
R49  68.5,99 270 top
R50  49.5,107.5 180 top
REF  11,90.75 180 top
RT1  37.5,99 0 bottom
RT2  32.5,99 0 bottom
RT3  27.5,99 0 bottom
RT4  22.5,99 0 bottom
RT5  17.5,99 0 bottom
SC1  64,18.5 90 bottom
SC2  68.5,18.5 90 bottom
SC3  64,6.5 90 bottom
SC4  68.5,6.5 90 bottom
SD1  5.5,102 180 top
SD2  5.5,83.5 0 top
SG1  64,42.5 90 bottom
SG2  68.5,42.5 90 bottom
SG3  64,30.5 90 bottom
SG4  68.5,30.5 90 bottom
SHIELD  35,30 180 top
U$1  [OSHW_8MM]  18.75,15 0 bottom

### Tracks (layer width: path | path; a pad name or v marks a point on that pad's centre or on a via)
+3V3  (via drill 0.5)
  Top 0.254: 1.25,27 1.25,32.75 2.35,33.85 R2.2 v3.25,38.25 | 1.25,27 1.25,20.5 | 1.25,20.5 1.25,15.6 R11.2 | R8.2 1.4,20.35 1.25,20.5 | R5.2 1.35,27.1 1.25,27
  Bottom 0.254: SHIELD.3.3V 10.44,33.81 8.75,35.5 8.75,37.25 6.25,39.75 4.75,39.75 v3.25,38.25
+5V  (via drill 0.5)
  Top 0.254: D7.C 14.1,15.1 v14.5,15.5 | D5.C 14.1,27.6 v14.5,28 | D3.C 14.1,40.1 v14.5,40.5 | D1.C 14.1,52.6 v14.5,53 | R32.2 R36.2 2.85,52.15 v2,53 | AC2.1 21.44,78.19 v21.75,78.5 21.4,78.15 DC2.1 | AC2.9 27.79,80.96 v28.25,80.5 | AC1.9 33.04,75.46 v33,75.5 | AC1.1 26.69,65.19 v26,64.5 24.75,65.75 DC1.1 | R28.2 45.25,73 v45.75,73.5 | R23.2 68.1,82.15 v68,82.25 | v36.5,43.5 37.5,44.5 37.5,55 v36.5,56 | D11.C 30,101 31.5,102.5 32.35,102.5 R37.1 v35.5,104 | R39.2 48.65,105.25 | 48.65,105.25 R50.2 | R49.2 v68.5,95.5 | v49.75,105.25 48.65,105.25
  pour Bottom: -0.5,110.5 71,110.5 71,-0.5 -0.5,-0.5
+12V  (via drill 0.8)
  Top 0.254: R38.2 12,96.25 v12.75,97
  Top 0.61: PC1.+ 8.85,106.5 FB1.2 9.35,106.35 v11,104.75 11,98.75 v12.75,97 | v32,54.5 v32,42 v32,29.5 v32,17 32,8.5 PR5.3 | OP1.8 22.59,94.41 v23,94 | AD.6 40.27,98.14 DC3.1 40,95.5 v38.5,94 38.5,91 38,90.5 OP2.4
  Bottom 0.61: PR4.3 v32,17 | v32,29.5 PR3.3 28,27.5 24.15,23.65 SHIELD.VIN | PR2.3 v32,42 | v32,54.5 PR1.3 23,54.5 19,58.5 15,58.5 2,71.5 2,99 7.75,104.75 v11,104.75 | v38.5,94 v23,94 15.75,94 v12.75,97
-12V  (via drill 0.8)
  Top 0.61: 30,47 30,59.5 PR1.1 | 30,47 30,34.5 | 30,34.5 30,22 | 30,22 30,9.5 PR5.1 | PR2.1 30,47 | PR3.1 30,34.5 | PR4.1 30,22 | v3.5,75 3.5,76.4 PC2.- 8.85,79 FB2.2 10.15,79.15 11.75,80.75 11.75,83.75 15.5,87.5 v15.5,89 15.5,90.5 OP1.4 | AD.3 49.37,98.14 49.5,98 49.5,93.15 49.9,92.75 DC4.1 v48,92 | OP2.11 29,90.5 v27.5,89
  Bottom 0.61: v3.5,75 3.5,71.5 15.5,59.5 PR1.1 | v15.5,89 v27.5,89 45,89 v48,92
A0
  Top 0.254: D2.C D1.A 17.25,50.75 7.1,40.6 7.1,32.15 | R2.1 R1.2 7.1,32.15 | SHIELD.A0 10.87,21.13 7.1,24.9 7.1,32.15
A1
  Top 0.254: D4.C D3.A 16.25,38.25 12.5,34.5 12.5,17.66 SHIELD.A1 9.5,17.4 9.5,21.5 5.6,25.4 R4.2 R5.1
A2
  Top 0.254: D6.C D5.A 17.9,24.4 15.5,22 15.5,18.12 SHIELD.A2 8,16.36 8,18 7.35,18.65 R7.2 R8.1
A3
  Top 0.254: D8.C D7.A 16.25,13.25 13.95,10.95 SHIELD.A3 6.45,10.95 R10.2 R11.1
AC1-A
  Top 0.254: R41.2 38.1,76.5 | 38.1,76.5 38.1,81.1 43.25,86.25 43.25,89.75 41.75,91.25 40.25,91.25 38.25,89.25 36.12,89.25 OP2.3 | C3.1 38,76.4 38.1,76.5
AC1-B
  Top 0.254: C2.1 R40.2 33,85.85 33,91 33.77,91.77 OP2.5
AC2-A
  Top 0.254: C5.1 R43.2 27.62,91.77 OP2.10
AC2-B
  Top 0.254: OP2.12 32.27,89.23 32.5,89 32.5,85.5 31.5,84.5 31.5,82.25 | 31.5,82.25 R42.2 | C4.1 31.6,82.15 31.5,82.25
CI1  (via drill 0.5)
  Top 0.254: R3.2 v5.5,38.5
  Bottom 0.254: SC1.O 64,14.25 62.25,12.5 62.25,3.75 61.25,2.75 42.75,2.75 39.5,6 32.25,6 29,2.75 23.25,2.75 19,7 19,18 15.5,21.5 3,21.5 1.75,22.75 1.75,23.75 5.5,27.5 v5.5,38.5
CI2  (via drill 0.5)
  Top 0.254: R6.2 3.35,30.35 v2.25,29.25
  Bottom 0.254: SC2.O 68.46,15.96 62.75,10.25 62.75,3.5 61.5,2.25 42.5,2.25 39.25,5.5 32.5,5.5 29.25,2.25 23,2.25 18.5,6.75 18.5,17.75 15.25,21 2.75,21 1.25,22.5 1.25,28.25 v2.25,29.25
CI3  (via drill 0.5)
  Top 0.254: R9.2 6.4,23.6 8.5,21.5 v8.5,19
  Bottom 0.254: v8.5,19 8.5,4.75 11.5,1.75 29.5,1.75 32.75,5 39,5 42.25,1.75 61.79,1.75 SC3.O
CI4  (via drill 0.5)
  Top 0.254: R12.2 6.6,16.85 v7,17.25
  Bottom 0.254: SC4.O 65.79,1.25 42,1.25 38.75,4.5 33,4.5 29.75,1.25 11.25,1.25 8,4.5 8,16.25 v7,17.25
DAC1  (via drill 0.5)
  Top 0.254: v60,63.5 60.5,63.5 62,62 62,46.5 61,45.5 61,32.25 62.75,30.5 62.75,26.75 64,25.5 SC1.S | OP2.1 34.81,86.69 34,87.5 v34,90.25 | R15.2 45.9,61.65 47,62.75 51.25,62.75 v53,64.5
  Bottom 0.254: RT1.1 37.54,96.46 40,94 40,89.75 | v34,90.25 34.5,89.75 40,89.75 | 40,89.75 44.25,89.75 48,93.5 61.75,93.5 63.5,91.75 63.5,79.25 62,77.75 62,64.5 61,63.5 v60,63.5 54,63.5 v53,64.5
DAC2  (via drill 0.5)
  Top 0.254: OP2.7 34.65,94.31 RT2.1 | v30.25,84 27.5,84 26,85.5 26,94.5 v25,95.5 | R16.2 v50.5,38.25 | v58,74 55.5,71.5 55.5,62.75 57.75,60.5 57.75,32.5 | 57.75,32.5 57.75,27.25 v56.75,26.25 | v55.25,35 57.75,32.5
  Bottom 0.254: v30.25,84 46.75,84 56.75,74 v58,74 | RT2.1 32.46,96.46 31,95 25.5,95 v25,95.5 | v55.25,35 53.75,35 v50.5,38.25 | SC2.S 68.46,21.04 63.5,26 60.75,26 60.25,25.5 57.5,25.5 v56.75,26.25
DAC3  (via drill 0.5)
  Top 0.254: v58,72 59.5,70.5 59.5,65.25 63,61.75 63,58.25 64.75,56.5 64.75,50 v63.25,48.5 | v28.75,86.75 30.84,86.75 OP2.14 | SC3.S 64,13.25 62.25,15 62.25,27.75 v62,28 | R17.2 53.35,26.4 v52.25,27.5
  Bottom 0.254: v58,72 47,83 29.5,83 28.75,83.75 v28.75,86.75 14.75,86.75 10.75,90.75 10.75,100 13.75,103 23,103 25.5,100.5 28.5,100.5 29,100 29,97.96 RT3.1 | v63.25,48.5 65.5,48.5 66.25,47.75 66.25,30 65.5,29.25 63.25,29.25 v62,28 60,26 58.5,26 57.5,27 52.75,27 v52.25,27.5
DAC4  (via drill 0.5)
  Top 0.254: SC4.S 68.5,14 67.25,15.25 67.25,26.75 66.25,27.75 66.25,46.75 66.75,47.25 66.75,59.75 66.5,60 v66.5,64.25 | OP2.8 28.44,94.31 26.5,96.25 26.5,96.5 25.5,97.5 23.54,97.5 RT4.1 | v21,104 v21,101.75 | 56.35,13.35 R18.2 56.35,12.4 v57.25,11.5 | v61,5.25 v65.25,5.25
  Bottom 0.254: v66.5,64.25 66.5,76.75 64,79.25 64,92 54.25,101.75 39.5,101.75 38.75,102.5 24.25,102.5 22.75,104 v21,104 | v21,101.75 21,97.96 RT4.1 | v57.25,11.5 57.25,5 58,4.25 60,4.25 v61,5.25 | SC4.S 68.5,8.5 v65.25,5.25
DC  (via drill 0.5)
  Top 0.254: v54,102.75 55.5,101.25 55.5,95 53.5,93 53.5,74.75 54,74.25 54,27 57.25,23.75 57.25,17.91 SHIELD.D4
  Bottom 0.254: OLED.DC 34.83,107.17 39.75,102.25 53.5,102.25 v54,102.75
ENCA  (via drill 0.5)
  Top 0.254: SHIELD.D10 60.5,33.91 60.5,45.75 61.5,46.75 61.5,61.75 60.5,62.75 59.25,62.75 58.5,63.5 v58.5,64.5
  Bottom 0.254: EN1.A 57.25,93 61.5,93 63,91.5 63,79.5 61.5,78 61.5,67.5 v58.5,64.5
ENCB  (via drill 0.5)
  Top 0.254: EN1.B 60,91.5 58.25,89.75 58.25,84.25 57.5,83.5 55.75,83.5 54.5,82.25 54.5,75.25 55,74.75 55,62.5 57.25,60.25 57.25,35.75 v56.5,35
  Bottom 0.254: v56.5,35 57.75,33.75 57.75,31.38 SHIELD.D9
ENCS  (via drill 0.5)
  Top 0.254: v68.5,59 69.25,59.75 69.25,89.75 61.75,97.25 61.75,100 EN1.D 53,106 50.35,103.35 R39.1 | v64.25,47.5 65.25,48.5 65.25,57.25 v64.25,58.25
  Bottom 0.254: v64.25,47.5 65.75,46 65.75,39.75 63.62,37.62 SHIELD.D12 | v64.25,58.25 67.75,58.25 v68.5,59
GND  (via drill 0.5, 0.8)
  Bottom 0.254: v28.5,71 v24.25,71
  Bottom 0.61: v44.5,29 38,29 v35,32 | SHIELD.GND@2 53.3,42.7 51.5,44.5 CO2.P$2 CO2.P$3 | CO1.P$2 CO1.P$3
  pour Top: -0.5,110.5 71,110.5 71,0 -0.5,-0.5
LDAC  (via drill 0.5)
  Top 0.254: AC2.8 29.06,79.69 v29.25,79.5 | v34.25,79.5 34.31,79.44 AC1.8 34.43,73.07 37.25,70.25 37.25,65.5 39,63.75 39,28 v39.5,27.5
  Bottom 0.254: v34.25,79.5 v29.25,79.5 | v39.5,27.5 40.54,27.46 50.46,27.46 52.5,29.5 57.09,29.5 SHIELD.D8
MOSI  (via drill 0.5)
  Top 0.254: v32.5,65 31.77,65.73 AC1.5 31.75,66.95 31.75,68.25 31,69 27.25,69 25.77,70.48 25.77,74.27 26.5,75 26.5,76.41 AC2.5 | v41.5,65 41,64.5 41,42.5 v41.5,42
  Bottom 0.254: v41.5,65 v32.5,65 31.5,65 26.75,60.25 15.75,60.25 9,67 9,75 9.75,75.75 9.75,100.5 13.25,104 16.5,104 18.5,106 27.75,106 OLED.SDA | v41.5,42 52,42 58.92,35.08 SHIELD.D11
N$3
  Bottom 0.254: CI1.P$2 24,55.5 26.5,55.5 PR1.2
N$4
  Bottom 0.254: CI2.P$2 24,43 26.5,43 PR2.2
N$5
  Bottom 0.254: CI3.P$2 24,30.5 26.5,30.5 PR3.2
N$6
  Bottom 0.254: CI4.P$2 24,18 26.5,18 PR4.2
N$7
  Bottom 0.254: OFT.P$2 24,5.5 26.5,5.5 PR5.2
N$8  (via drill 1)
  Top 0.254: OFT.P$1 14,9 16,11 23.15,11 R13.1 25.15,9.15 26.5,10.5 26.5,11.5 v28,13
N$9  (via drill 1)
  Top 0.254: R1.1 R3.1 4.5,36.4 4.5,43.25 v3.25,44.5 14,55.25 CI1.P$1
N$10  (via drill 0.5, 1)
  Top 0.254: R4.1 R6.1 4.35,28.65 v3.75,29.25
  Bottom 0.254: v3.75,29.25 2,31 2,40.75 v3.25,42 5.75,44.5 CI2.P$1
N$11  (via drill 0.5, 1)
  Top 0.254: R7.1 R9.1 4.35,21.9 v3.25,23 | CI3.P$1 13,31 13,23 v13.5,22.5
  Bottom 0.254: v3.25,23 4.25,22 13,22 v13.5,22.5
N$12  (via drill 1)
  Top 0.254: R10.1 R12.1 4.1,15.15 v3.25,16
  Bottom 0.254: CI4.P$1 13,20.5 7.75,20.5 v3.25,16
N$13  (via drill 1)
  Top 0.254: R33.1 R34.1 4.5,62.5 GT1.P$1 7.5,64.5 v12.75,69.75
N$14  (via drill 1)
  Top 0.254: FNC.P$1 56,8.1 50.85,13.25 R14.1 48.1,13.1 47,12 45.5,12 44.5,13 v44.5,14.5
N$15  (via drill 0.5)
  Top 0.254: SC4.P 68.5,6.75 66.75,8.5 66.75,26.5 65.75,27.5 65.75,47 66.25,47.5 66.25,58.5 64.25,60.5 v64.25,61.75 | AD.2 46.12,96.86 45.75,96.5 45.75,82.75 47.25,81.25 v47.25,65
  Bottom 0.254: v64.25,61.75 60.75,61.75 60.25,62.25 50,62.25 v47.25,65
N$16  (via drill 0.5)
  Top 0.254: SC3.P 66.25,8.75 66.25,26.25 65.25,27.25 65.25,47.25 65.75,47.75 65.75,58 63.5,60.25 v63.5,62.75 | AD.1 46.25,94.25 46.25,83 47.75,81.5 47.75,65.75 v48.5,65
  Bottom 0.254: v48.5,65 50.75,62.75 v63.5,62.75
N$17  (via drill 1)
  Top 0.254: R26.1 R25.1 44.9,65.1 46.75,63.25 | 46.75,63.25 49.75,63.25 GT3.P$1 | v44.5,61 46.75,63.25
N$18  (via drill 1)
  Top 0.254: R20.1 65.65,62.35 GT4.P$1 61,64.5 60,65.5 60,74 58.85,75.15 R21.1 55.85,75.15 55,76 55,80.5 v56.75,82.25
N$19  (via drill 1)
  Top 0.254: R29.1 R30.1 15.65,64.5 | GT2.P$1 15.65,64.5 | 15.65,64.5 15.5,64.5 v12.75,67.25
N$20  (via drill 0.5)
  Top 0.254: AD.8 43.75,94.25 43.75,86 39,81.25 39,64.5 39.5,64 39.5,29.25 40.5,28.25 40.5,24 41,23.5 v41,9.75
  Bottom 0.254: SC2.P 68.25,18.5 67,17.25 63.5,17.25 62.75,16.5 62.75,13.75 61.75,12.75 61.75,4 61,3.25 43,3.25 41,5.25 v41,9.75
N$21  (via drill 0.5)
  Top 0.254: AD.7 43.88,96.86 44.25,96.5 44.25,85.75 39.5,81 39.5,64.75 40,64.25 40,32.5 41.5,31 v41.5,25 | SC1.P 62.75,19.75 62.75,24.5 v63.25,25
  Bottom 0.254: v63.25,25 v41.5,25
N$22  (via drill 0.5, 1)
  Top 0.254: v44.5,47 46,47 46.5,47.5 46.5,49.65 R15.1 v52.5,50.75 | CO1.P$1 v56,52
  Bottom 0.254: v56,52 53.75,52 v52.5,50.75
N$23  (via drill 0.5, 1)
  Top 0.254: R16.1 46,38.25 v44.5,39.75 | CO2.P$1 v56,36.5
  Bottom 0.254: v56,36.5 52.75,39.75 v44.5,39.75
N$24  (via drill 1)
  Top 0.254: R18.1 54.65,18.15 CO4.P$1
  Bottom 0.254: v44.5,17 53.5,17 CO4.P$1
N$25  (via drill 0.5, 1)
  Top 0.254: R17.1 51.65,26.35 v49.75,28.25
  Bottom 0.254: CO3.P$1 49.75,32 | 49.75,32 v44.5,37.25 | 49.75,32 v49.75,28.25
N$26  (via drill 0.5)
  Top 0.254: R25.2 44,63 42.5,61.5 42.5,50 v43,49.5
  Bottom 0.254: SG3.O 64.96,27.96 66.75,29.75 66.75,50.25 64.75,52.25 58.25,52.25 54.75,48.75 43.75,48.75 v43,49.5
N$27
  Top 0.254: SG4.O 66.75,29.71 66.75,46.5 67.25,47 67.25,61.15 R20.2
N$28  (via drill 0.5)
  Top 0.254: R29.2 5.4,56.15 v5.25,56
  Bottom 0.254: v5.25,56 5.75,55.5 21,55.5 24,52.5 27.5,52.5 33.25,46.75 36.75,46.75 45.75,55.75 56.75,55.75 57.25,56.25 67.75,56.25 69.75,54.25 69.75,41.25 68.5,40 SG2.O
N$29  (via drill 0.5)
  Top 0.254: R33.2 2.15,59.65 1.25,58.75 1.25,55.75 v2,55 | v63.25,49.75 64.25,50.75 64.25,54.5 v63.25,55.5
  Bottom 0.254: v2,55 20.75,55 23.75,52 27.25,52 33,46.25 37,46.25 46,55.25 63,55.25 v63.25,55.5 | SG1.O 64,40 65.25,41.25 65.25,45.75 64.5,46.5 64,46.5 62.5,48 62.5,49 v63.25,49.75
N$30  (via drill 0.5)
  Top 0.254: Q2.C 42.9,72.6 45.1,70.4 R28.1 45.25,69.75 v46,69 | SG3.S 63.96,33.04 61.5,35.5 61.5,45.25 62.5,46.25 62.5,56.5 v63,57
  Bottom 0.254: v46,69 46,63.25 50,59.25 60.75,59.25 v63,57
N$31
  Top 0.254: R21.2 R22.2 57.8,79.45 Q1.B
N$32
  Top 0.254: Q1.C 63.25,78.5 65.75,76 R23.1 66.4,74.85 68.75,72.5 68.75,60.75 67.75,59.75 67.75,46.75 67.25,46.25 67.25,34.29 SG4.S
N$33
  Top 0.254: R31.2 R30.2 9,54.4 Q3.B
N$34
  Top 0.254: C1.1 27.95,103.9 D11.A 32.05,103.9 R37.2 32.29,104.14 OLED.RES
N$35  (via drill 0.5)
  Top 0.254: R45.2 37.4,98.9 RT1.2 | OP2.2 38.96,87.96 41,90 v41,90.5
  Bottom 0.254: v41,90.5 41,95.5 RT1.2
N$36
  Top 0.254: OP2.6 34.46,93.04 32.5,95 31.15,95 R46.2 30.15,96.15 32.5,98.5 RT2.2
N$37
  Top 0.254: OP1.6 OP1.7 19.36,93.14 19,93.5 19,97.9 R47.1 20.9,98 24,98 24.9,98.9 R48.1 26.05,97.85 R46.1 30,98 32,100 34.4,100 R45.1
N$39  (via drill 0.5)
  Top 0.254: OP2.9 28.96,93.04 25.25,96.75 v25,96.75 | R47.2 20.9,100.6 RT4.2
  Bottom 0.254: RT4.2 22.75,99 v25,96.75
N$41  (via drill 0.5)
  Top 0.254: v28.75,88 30.86,88 OP2.13 | R48.2 25.9,100.6 RT3.2
  Bottom 0.254: v28.75,88 14.25,88 11.25,91 11.25,99.75 14,102.5 22.75,102.5 26.25,99 RT3.2
N$42
  Top 0.254: R26.2 R27.2 41.75,69 41.05,69.7 Q2.B
N$46  (via drill 0.5)
  Top 0.254: R32.1 4.5,48.65 Q3.C 5.9,52.15 v5.25,51.5 | SG2.S 68.5,50.5 68.25,50.75 68.25,53.75 v68.5,54
  Bottom 0.254: v5.25,51.5 7.75,54 20.25,54 23.25,51 26.75,51 32.5,45.25 37.5,45.25 45.5,53.25 67.75,53.25 v68.5,54
N$47
  Top 0.254: R35.2 R34.2 4.5,57.9 Q4.B
N$48  (via drill 0.5)
  Top 0.254: Q4.C 3.5,54 | 3.5,54 R36.1 | 3.5,54 v5.25,54 | v63.25,51 v63.25,54.25
  Bottom 0.254: v5.25,54 5.75,54.5 20.5,54.5 23.5,51.5 27,51.5 32.75,45.75 37.25,45.75 46.25,54.75 62.75,54.75 v63.25,54.25 | SG1.S 63.96,45.04 62,47 62,49.75 v63.25,51
N$49
  Top 0.254: D9.A 49.5,83.24 PB1.3
N$50
  Top 0.254: GT3.P$2 49.5,74.5 D9.C 49.5,78.65 R24.2
N$51
  Top 0.254: AC1.10 31.77,75.77 33,77 33,80.15 R40.1
N$52
  Top 0.254: D10.A 60.35,84.59 PB2.3
N$53
  Top 0.254: GT4.P$2 60.5,76 60.5,79.5 61.25,80.25 62.4,80.25 | 62.4,80.25 D10.C | R19.2 63.75,78.9 62.4,80.25
N$54
  Top 0.254: AC1.14 26.69,71.31 28.5,69.5 R41.1
N$55
  Top 0.254: R42.1 28.35,78.15 26.52,79.98 AC2.10
N$56
  Top 0.254: AC2.14 21.44,87.29 R43.1
N$57
  Top 0.61: SD2.C 3.3,87.09 PWR.1
  Bottom 0.61: PWR.2 PWR.1
N$58
  Top 0.61: FB2.1 9,82.2 SD2.A
N$59
  Top 0.61: FB1.1 9,103.3 SD1.C
N$60
  Top 0.61: SD1.A 3.3,98.91 PWR.9
  Bottom 0.61: PWR.10 PWR.9
N$62
  Top 0.254: SHIELD.TX 59.13,8.38 57.75,7 57.75,5.25 54.25,1.75 40.5,1.75 37.25,5 32.75,5 29.5,1.75 9,1.75 6.5,4.25 3.6,4.25 PSW.1
N$63
  Top 0.254: SHIELD.RX 54.5,1.25 40.25,1.25 37,4.5 33,4.5 29.75,1.25 7.4,1.25 PSW.4
N$64
  Top 0.254: 14.9,99 R44.1 15.1,99 RT5.2 18.5,98 18.5,91 18.91,90.59 OP1.5
N$68
  Top 0.254: OP1.3 11.96,91.86 | 11.96,91.86 REF.1 | 11.96,91.86 11.96,93.61 R38.1
PD0  (via drill 0.5)
  Top 0.254: v6.25,9.75 7.5,8.5 7.5,4.75 9.5,2.75 29,2.75 32.25,6 39.75,6 42.5,8.75 42.5,25.5 42,26 42,39.75 43,40.75 v43,48.25
  Bottom 0.254: v6.25,9.75 4.75,9.75 4,9 4,7.15 PSW.5 | SG1.P 61.5,42.5 60.5,43.5 60.5,51 59.75,51.75 58.5,51.75 55,48.25 v43,48.25
PD1  (via drill 0.5)
  Top 0.254: PSW.2 3.6,6.75 6.5,6.75 7,6.25 7,4.5 9.25,2.25 29.25,2.25 32.5,5.5 40,5.5 43,8.5 43,25.75 42.5,26.25 42.5,39.5 46,43 46,45.5 v50.25,49.75 | SG2.P 69.75,43.75 69.75,51.5 v69,52.25
  Bottom 0.254: v50.25,49.75 53.25,52.75 68.5,52.75 v69,52.25
PD2  (via drill 0.5)
  Top 0.254: v61,23.25 v61,30.5
  Bottom 0.254: SHIELD.D2 59.2,10.95 62.25,14 62.25,22 v61,23.25 | SG3.P v61,30.5
PD3  (via drill 0.5)
  Top 0.254: v64.75,26.25 65.75,25.25 65.75,14.75 v65,14 | SHIELD.D3 61.51,13.49 v63,12
  Bottom 0.254: v63,12 v65,14 | v64.75,26.25 64.75,26.75 SG4.P
SCK  (via drill 0.5)
  Top 0.254: v32,64 30.5,65.5 AC1.4 30.5,68.25 30.25,68.5 27,68.5 25.25,70.25 AC2.4 v25.25,78.5 | v18,104 20,106 25.21,106 OLED.SCK | v42,62.25 v42,43.25
  Bottom 0.254: v32,64 40.25,64 v42,62.25 | SHIELD.D13 54.59,40.16 52.25,42.5 42.75,42.5 v42,43.25 | v25.25,78.5 23.75,80 18.25,80 10.25,88 10.25,100.25 13.5,103.5 17.5,103.5 v18,104
SCL  (via drill 0.5)
  Top 0.254: v58.5,60.25 58.5,50.94 SHIELD.SCL | 68.52,99.85 I2C.5
  Top 0.406: R49.1 68.52,99.85
  Bottom 0.254: v58.5,60.25 67.25,60.25 68.25,61.25 68.25,76.5 65,79.75 65,93.75 68.52,97.27 I2C.5 I2C.6
SDA  (via drill 0.5)
  Top 0.254: v60,61.25 60.5,60.75 60.5,49.15 SHIELD.SDA | R50.1 63.73,107.5 I2C.4
  Bottom 0.254: v60,61.25 60.5,60.75 67,60.75 67.75,61.5 67.75,76.25 64.5,79.5 64.5,92.25 61.75,95 61.75,101.02 I2C.4 I2C.3
SS0  (via drill 0.5)
  Top 0.254: AC1.3 29.23,63.27 33.5,59 36.5,59 38.5,57 38.5,26 v39.5,25
  Bottom 0.254: SHIELD.D7 40.85,23.65 v39.5,25
SS1  (via drill 0.5)
  Top 0.254: AC2.3 23.98,72.48 23,71.5 23,65 25,63 28.75,63 33.25,58.5 36.25,58.5 38,56.75 38,23.5 v39.5,22
  Bottom 0.254: SHIELD.D6 40.39,21.11 v39.5,22
SS2  (via drill 0.5)
  Top 0.254: v54,104 56,102 56,94.75 54,92.75 54,75 54.5,74.5 54.5,27.25 57.75,24 57.75,19.95 SHIELD.D5
  Bottom 0.254: OLED.CS 37.37,105.38 40,102.75 52.75,102.75 v54,104
VREF  (via drill 0.5)
  Top 0.254: AC2.13 22.71,81.04 23.25,80.5 v25.25,80.5 AC2.11 | 30.5,74.75 AC1.11 30.5,71.5 v31.5,70.5 | 30.5,74.75 28.5,74.75 28,74.25 28,73.11 AC1.13 | 30.5,74.75 v30.5,75.5 | SHIELD.AREF 59.24,45.24 61,47 61,61.5 60.25,62.25 58,62.25 57.5,62.75 57.5,69.5 v58,70 | RT5.1 15.45,94.41 OP1.1 OP1.2 16.86,93.14 17.25,92.75 17.25,86.75 v16.5,86
  Bottom 0.254: v30.5,75.5 30.25,75.5 v25.25,80.5 18.5,80.5 16.5,82.5 v16.5,86 | v31.5,70.5 57.5,70.5 v58,70
W  (via drill 0.5)
  Top 0.254: AD.5 44.09,99.41 44.75,98.75 44.75,85.5 40,80.75 40,65 40.5,64.5 40.5,39 v41.25,38.25 | v46,33.5 46,17.65 46.4,17.25 R14.2
  Bottom 0.254: v41.25,38.25 v46,33.5
Z  (via drill 0.5)
  Top 0.254: R13.2 25,16 24,17 24,22 25.5,23.5 25.5,28 24,29.5 24,34.5 25.5,36 25.5,40.5 24,42 24,47 25.5,48.5 25.5,52.5 24,54 24,59.5 v26,61.5 | AD.4 45.91,99.41 45.25,98.75 v45.25,82
  Bottom 0.254: v45.25,82 41,82 28,69 28,63.5 v26,61.5

### Text on the board
tPlace: FB1 | PC1 | FB2 | PC2
bPlace: +12V | -12V | 1 | 0 | SG1 | SG2 | SG3 | SG4 | SC1 | SC2 | SC3 | SC4 | DU-INO (REV C)